# Altium schematic sheet schematic_mach_boost_6009.SchDoc
size A; SheetNumber: 1; SheetTotal: 1
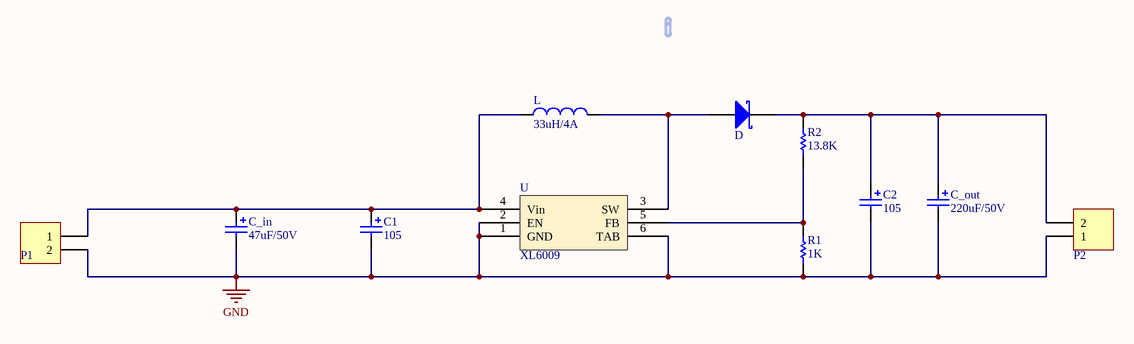
[diagram p0: schematic_mach_boost_6009.SchDoc]

## Parts
C1  value 105  [CAP ALU SIZE B]  (hidden comment: Cap Pol SMD)
C2  value 105  [CAP ALU SIZE B]  (hidden comment: Cap Pol SMD)
C_in  value 47uF/50V  [CP1/2]  (hidden comment: Cap Pol)
C_out  value 220uF/50V  [CP1/2]  (hidden comment: Cap Pol)
D  D Schottky  [SS34]  (value not drawn)
L  value 33uH/4A  [INDUCTOR 12.5x12.5]  (hidden comment: Inductor)
P1  Domino 2  [DOMINO 2- 5mm]  (value not drawn)
P2  Domino 2  [DOMINO 2- 5mm]  (value not drawn)
R1  value 1K  [RES-SM-0603]  (hidden comment: RESISTOR SMD)
R2  value 13.8K  [RES-SM-0603]  (hidden comment: RESISTOR SMD)
U  XL6009  [LM2596]

## Nets
GND: C1.2 C2.2 C_in.2 C_out.2 P1.2 P2.1 R1.1 U.1(GND) U.2(EN) U.6(TAB)
NetC1_1: C1.1 C_in.1 L.1 P1.1 U.4(Vin)
NetC2_1: C2.1 C_out.1 D.2(K) P2.2 R2.2
NetD_1: D.1(A) L.2 U.3(SW)
NetR1_2: R1.2 R2.1 U.5(FB)

## Library data of the parts
C1 C2 = Cap Pol SMD: Polarized Capacitor (Radial)
C_in C_out = Cap Pol: Polarized Capacitor (Radial)
D = D Schottky: Schottky Diode; Published: 8-Jun-2000; LatestRevisionDate: 17-Jul-2002; LatestRevisionNote: Re-released for DXP Platform.; PackageReference: SMB; Publisher: Altium Limited; PackageDescription: DO-214-AA/SMB; 2 C-Bend Leads; Body 5.3 x 3.6 mm, inc. leads (LxW); Code_JEDEC: DO-214-AA
P1 P2 = Domino 2: Domino, 2-Pin; LatestRevisionDate: 17-Jul-2002; LatestRevisionNote: Re-released for DXP Platform.; Publisher: Altium Limited
R1 R2 = RESISTOR SMD: Resistor
U = XL6009: SMD